# EAGLE design powersensor (EAGLE 7.7.0)
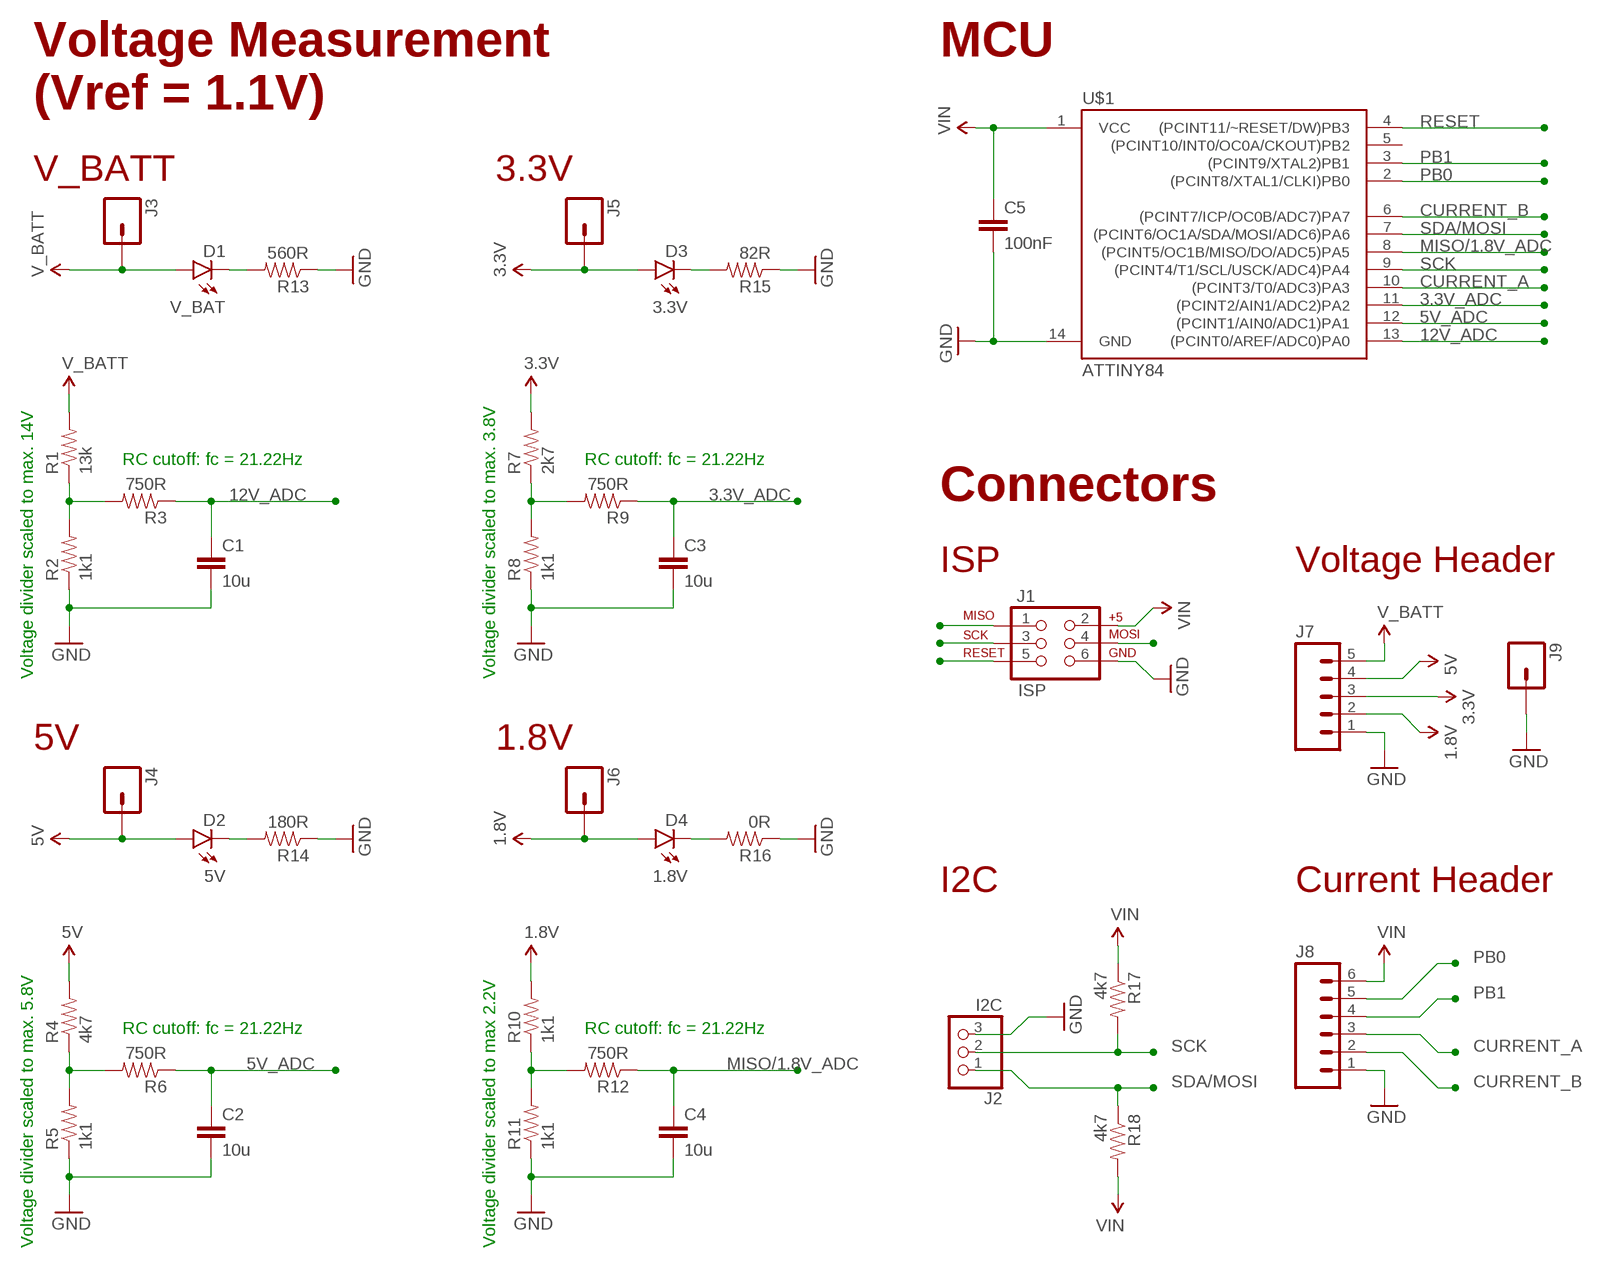
[diagram p0: schematic, sheet 1]

## Parts
C1  10u  CAP0603-CAP  [0603-CAP]
C2  10u  CAP0603-CAP  [0603-CAP]
C3  10u  CAP0603-CAP  [0603-CAP]
C4  10u  CAP0603-CAP  [0603-CAP]
C5  100nF  CAP0603-CAP  [0603-CAP]
D1  V_BAT  LED0603  [LED-0603]
D2  5V  LED0603  [LED-0603]
D3  3.3V  LED0603  [LED-0603]
D4  1.8V  LED0603  [LED-0603]
J1  ISP  AVR_SPI_PRG_6PTH  [2X3]
J2  I2C  PINHD-1X3/90  [1X03/90]
J3  M01PTH  [1X01]
J4  M01PTH  [1X01]
J5  M01PTH  [1X01]
J6  M01PTH  [1X01]
J7  M05PTH  [1X05]
J8  M06SILK_FEMALE_PTH  [1X06]
J9  M01PTH  [1X01]
R1  13k  RESISTOR0603-RES  [0603-RES]
R2  1k1  RESISTOR0603-RES  [0603-RES]
R3  750R  RESISTOR0603-RES  [0603-RES]
R4  4k7  RESISTOR0603-RES  [0603-RES]
R5  1k1  RESISTOR0603-RES  [0603-RES]
R6  750R  RESISTOR0603-RES  [0603-RES]
R7  2k7  RESISTOR0603-RES  [0603-RES]
R8  1k1  RESISTOR0603-RES  [0603-RES]
R9  750R  RESISTOR0603-RES  [0603-RES]
R10  1k1  RESISTOR0603-RES  [0603-RES]
R11  1k1  RESISTOR0603-RES  [0603-RES]
R12  750R  RESISTOR0603-RES  [0603-RES]
R13  560R  RESISTOR0603-RES  [0603-RES]
R14  180R  RESISTOR0603-RES  [0603-RES]
R15  82R  RESISTOR0603-RES  [0603-RES]
R16  0R  RESISTOR0603-RES  [0603-RES]
R17  4k7  RESISTOR0603-RES  [0603-RES]
R18  4k7  RESISTOR0603-RES  [0603-RES]
U$1  ATTINY84  [SO14]

## Nets
1.8V: D4.A J6.1 J7.2 R10.2
3.3V: D3.A J5.1 J7.3 R7.2
3.3V_ADC: C3.1 R9.1 U$1.11((PCINT2/AIN1/ADC2)PA2)
5V: D2.A J4.1 J7.4 R4.2
5V_ADC: C2.1 R6.1 U$1.12((PCINT1/AIN0/ADC1)PA1)
12V_ADC: C1.1 R3.1 U$1.13((PCINT0/AREF/ADC0)PA0)
CURRENT_A: J8.3 U$1.10((PCINT3/T0/ADC3)PA3)
CURRENT_B: J8.2 U$1.6((PCINT7/ICP/OC0B/ADC7)PA7)
GND: C1.2 C2.2 C3.2 C4.2 C5.2 J1.6 J2.3 J7.1 J8.1 J9.1 R2.1 R5.1 R8.1 R11.1 R13.1 R14.1 R15.1 R16.1 U$1.14(GND)
MISO/1.8V_ADC: C4.1 J1.1 R12.1 U$1.8((PCINT5/OC1B/MISO/DO/ADC5)PA5)
N$1: R1.1 R2.2 R3.2
N$2: R4.1 R5.2 R6.2
N$3: R7.1 R8.2 R9.2
N$4: R10.1 R11.2 R12.2
N$5: D1.C R13.2
N$6: D2.C R14.2
N$7: D3.C R15.2
N$8: D4.C R16.2
PB0: J8.5 U$1.2((PCINT8/XTAL1/CLKI)PB0)
PB1: J8.4 U$1.3((PCINT9/XTAL2)PB1)
RESET: J1.5 U$1.4((PCINT11/~RESET/DW)PB3)
SCK: J1.3 J2.2 R17.2 U$1.9((PCINT4/T1/SCL/USCK/ADC4)PA4)
SDA/MOSI: J1.4 J2.1 R18.1 U$1.7((PCINT6/OC1A/SDA/MOSI/ADC6)PA6)
V_BATT: D1.A J3.1 J7.5 R1.2
VIN: C5.1 J1.2 J8.6 R17.1 R18.2 U$1.1(VCC)
Unconnected: U$1.5((PCINT10/INT0/OC0A/CKOUT)PB2)

## Notes on the sheet
- MCU
- Voltage Measurement
  (Vref = 1.1V)
- V_BATT | 3.3V
- RC cutoff: fc = 21.22Hz | RC cutoff: fc = 21.22Hz
- Connectors
- ISP | Voltage Header
- Voltage divider scaled to max. 14V | Voltage divider scaled to max. 3.8V
- 5V | 1.8V
- I2C | Current Header
- RC cutoff: fc = 21.22Hz | RC cutoff: fc = 21.22Hz
- Voltage divider scaled to max. 5.8V | Voltage divider scaled to max 2.2V

## Library data of the parts
C1-C5 = SparkFun-Capacitors:CAP: Capacitor Standard 0603 ceramic capacitor, and 0.1" leaded capacitor.
D1-D4 = SparkFun-LED:LED: LEDs Standard schematic elements and footprints for 5mm, 3mm, 1206, and 0603 sized LEDs. 5mm - Spark Fun Electronics SKU : COM-00529 (and others)
J1 = SparkFun-Connectors:AVR_SPI_PRG_6: AVR ISP 6 Pin This is the reduced ISP connector for AVR programming. Common on Arduino. This footprint will take up less PCB space and can be used with a 10-pin to 6-pin adapter such as SKU: BOB-08508 **Special note about "TEST_POINT" package. The stop mask is on the top side, so if you want your programming test points to be on the bottom of your board, make sure to place this package on the bottom side of the board. This also ensure that the orientation to program from the bottom side will be correct.
J2 = pinhead:PINHD-1X3: PIN HEADER
J3-J6 J9 = SparkFun-Connectors:M01: Header 1 Standard 1-pin 0.1" header. Use with straight break away headers (SKU : PRT-00116), right angle break away headers (PRT-00553), swiss pins (PRT-00743), machine pins (PRT-00117), and female headers (PRT-00115). SMTSO-256-ET is a "flush mount" nut for a 4-40 screw. The older package used to be too tight, and did not allow it to sit properly thru the drill hit. The latest (0.165DIA) fits nice and snug.
J7 = SparkFun-Connectors:M05: Header 5 Standard 5-pin 0.1" header. Use with straight break away headers (SKU : PRT-00116), right angle break away headers (PRT-00553), swiss pins (PRT-00743), machine pins (PRT-00117), and female headers (PRT-00115). Molex polarized connector foot print use with SKU : PRT-08230 with associated crimp pins and housings.
J8 = SparkFun-Connectors:M06: Header 6 Standard 6-pin 0.1" header. Use with straight break away headers (SKU : PRT-00116), right angle break away headers (PRT-00553), swiss pins (PRT-00743), machine pins (PRT-00117), and female headers (PRT-00115). Molex polarized connector foot print use with SKU : PRT-08094 with associated crimp pins and housings. NOTES ON THE VARIANTS LOCK and LOCK_LONGPADS... This footprint was designed to help hold the alignment of a through-hole component (i.e. 6-pin header) while soldering it into place. You may notice that each hole has been shifted either up or down by 0.005 of an inch from it's more standard position (which is a perfectly straight line). This slight alteration caused the pins (the squares in the middle) to touch the edges of the holes. Because they are alternating, it causes a "brace" to hold the component in place. 0.005 has proven to be the perfect amount of "off-center" position when using our standard breakaway headers. Although looks a little odd when you look at the bare footprint, once you have a header in there, the alteration is very hard to notice. Also,if you push a header all the way into place, it is covered up entirely on the bottom side. This idea of altering the position of holes to aid alignment will be further integrated into the Sparkfun Library for other footprints. It can help hold any component with 3 or more connection pins.; PROD_ID: CONN-08437
R1-R18 = SparkFun-Passives:RESISTOR: Resistor Basic schematic elements and footprints for 0603, 1206, and PTH resistors.
U$1 = SparkFun-DigitalIC:ATTINY84: Atmel 14-pin 2/4/8kB flash uC; PROD_ID: IC-11285

## Board
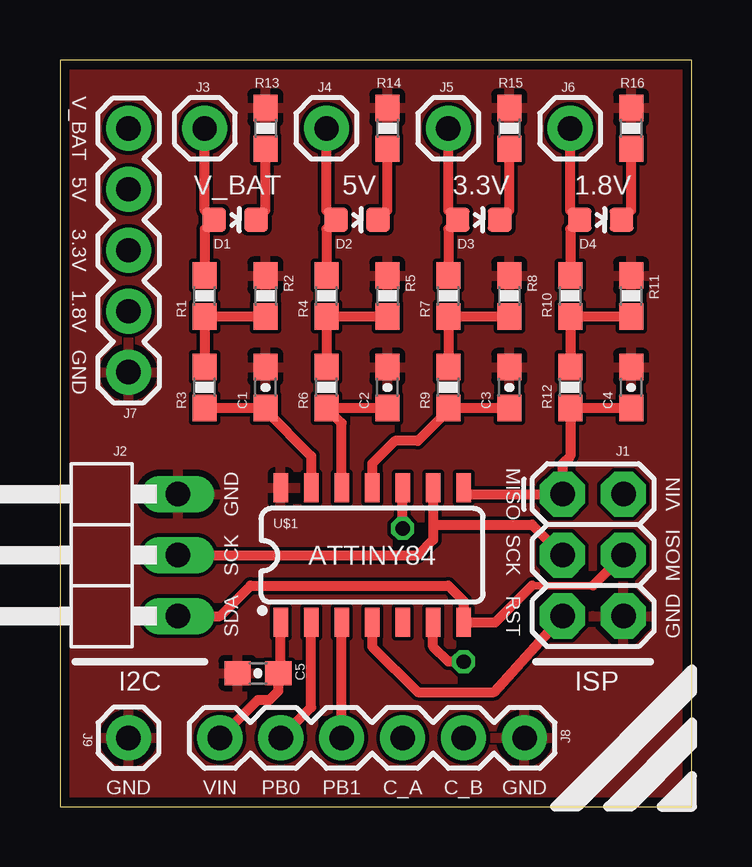
[diagram p1: board, top side]
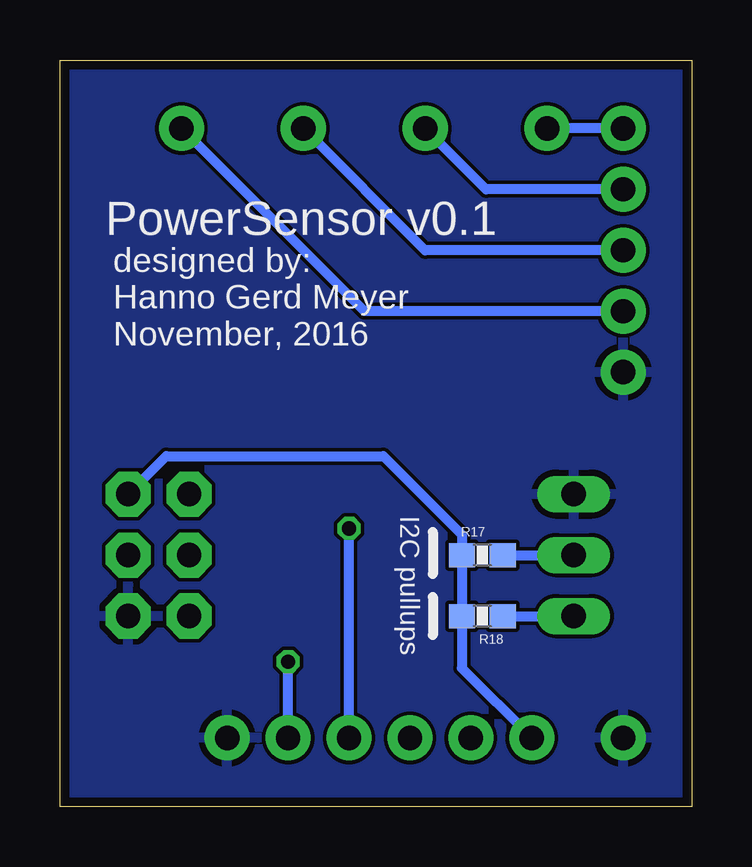
[diagram p2: board, bottom side, seen from below]

Size 26.34 x 31.11 mm. Coordinates in mm from the lower left corner, seen from the top.
Outline: 0,0 26.34,0 26.34,31.11 0,31.11 0,0
Copper layers (1*16): Top 0.0356mm / dielectric 1.5011mm / Bottom 0.0356mm
Design rules "oshpark-2layer": minimum track width 6mil, minimum drill 13mil, track to track 6mil, track to pad 6mil, pad to pad 6mil, via to via 6mil, smd to smd 6mil, copper to edge 15mil, drill to drill 6mil, minimum pad ring 7mil, minimum via ring 7mil, stop-mask expansion 2.5mil, vias tented up to drill 0mil, thermal gap 10mil

### Footprints (pad centres in the part's own frame; a part is rotated, then mirrored left to right if it is on the bottom)
0603-CAP = smd 1.1 x 1: 1 -0.85,0; 2 0.85,0
LED-0603 = smd 1 x 1: A 0,-0.877; C 0,0.877
2X3 = drill 1.016 pad 1.88 octagon: 1 0,0; 2 0,2.54; 3 2.54,0; 4 2.54,2.54; 5 5.08,0; 6 5.08,2.54
1X03/90 = drill 1.016 long: 1 -2.54,-3.81; 2 0,-3.81; 3 2.54,-3.81
1X01 = drill 1.016 pad 1.88: 1 0,0
1X05 = drill 1.016 pad 1.88: 1 0,0; 2 2.54,0; 3 5.08,0; 4 7.62,0; 5 10.16,0
1X06 = drill 1.016 pad 1.88: 1 0,0; 2 2.54,0; 3 5.08,0; 4 7.62,0; 5 10.16,0; 6 12.7,0
0603-RES = smd 1.1 x 1: 1 -0.85,0; 2 0.85,0
SO14 = smd 0.6 x 1.2: 1 -3.81,-2.8; 2 -2.54,-2.8; 3 -1.27,-2.8; 4 0,-2.8; 5 1.27,-2.8; 6 2.54,-2.8; 7 3.81,-2.8; 8 3.81,2.8; 9 2.54,2.8; 10 1.27,2.8; 11 0,2.8; 12 -1.27,2.8; 13 -2.54,2.8; 14 -3.81,2.8

### Placement (x,y rotation side)
C1  8.57,17.46 90 top
C2  13.65,17.46 90 top
C3  18.73,17.46 90 top
C4  23.81,17.46 90 top
C5  8.26,5.56 180 top
D1  7.3,24.45 270 top
D2  12.38,24.45 270 top
D3  17.46,24.45 270 top
D4  22.54,24.45 270 top
J1  20.95,13.02 270 top
J2  1.11,10.48 90 top
J3  6.03,28.26 90 top
J4  11.11,28.26 90 top
J5  16.19,28.26 90 top
J6  21.27,28.26 270 top
J7  2.86,18.1 90 top
J8  19.37,2.86 180 top
J9  2.86,2.86 0 top
R1  6.03,21.27 90 top
R2  8.57,21.27 270 top
R3  6.03,17.46 90 top
R4  11.11,21.27 90 top
R5  13.65,21.27 270 top
R6  11.11,17.46 90 top
R7  16.19,21.27 90 top
R8  18.73,21.27 270 top
R9  16.19,17.46 90 top
R10  21.27,21.27 90 top
R11  23.81,21.27 270 top
R12  21.27,17.46 90 top
R13  8.57,28.26 270 top
R14  13.65,28.26 270 top
R15  18.73,28.26 270 top
R16  23.81,28.26 270 top
R17  8.73,10.48 0 bottom
R18  8.73,7.94 180 bottom
U$1  13.02,10.48 0 top

### Tracks (layer width: path | path; a pad name or v marks a point on that pad's centre or on a via)
1.8V
  Top 0.406: J6.1 21.27,24.84 D4.A 21.27,24.05 R10.2
  Bottom 0.406: J7.2 13.65,20.64 J6.1
3.3V
  Top 0.406: J5.1 16.19,24.84 D3.A 16.19,24.05 R7.2
  Bottom 0.406: J7.3 11.11,23.18 J5.1
3.3V_ADC
  Top 0.406: C3.1 R9.1 16.19,16.51 14.92,15.24 13.97,15.24 13.02,14.29 U$1.11
5V
  Top 0.406: J4.1 11.11,24.84 D2.A 11.11,24.05 R4.2
  Bottom 0.406: J7.4 8.57,25.72 J4.1
5V_ADC
  Top 0.406: C2.1 R6.1 11.75,15.98 U$1.12
12V_ADC
  Top 0.406: R3.1 C1.1 8.57,16.51 10.48,14.61 U$1.13
CURRENT_A  (via drill 0.6)
  Top 0.406: v14.29,11.59 U$1.10
  Bottom 0.406: J8.3 v14.29,11.59
CURRENT_B  (via drill 0.6)
  Top 0.406: v16.83,6.03 16.19,6.03 15.56,6.67 U$1.6
  Bottom 0.406: J8.2 v16.83,6.03
GND
  pour Top: 0,31.11 26.35,31.11 26.35,0 0,0
  pour Bottom: 0,31.11 26.35,31.11 26.35,0 0,0
MISO/1.8V_ADC
  Top 0.406: C4.1 R12.1 21.27,14.61 20.95,14.29 J1.1 16.83,13.02 U$1.8
N$1
  Top 0.406: R3.2 R1.1 R2.2
N$2
  Top 0.406: R5.2 R4.1 R6.2
N$3
  Top 0.406: R8.2 R7.1 R9.2
N$4
  Top 0.406: R11.2 R10.1 R12.2 21.27,18.73
N$5
  Top 0.406: D1.C 8.57,24.84 R13.2
N$6
  Top 0.406: D2.C 13.65,24.84 R14.2
N$7
  Top 0.406: D3.C 18.73,24.84 R15.2
N$8
  Top 0.406: D4.C 23.81,24.84 R16.2
PB0
  Top 0.406: J8.5 10.48,4.13 U$1.2
PB1
  Top 0.406: J8.4 U$1.3
RESET
  Top 0.406: U$1.4 13.02,6.67 14.92,4.76 18.1,4.76 J1.5
SCK
  Top 0.406: 15.56,11.75 19.68,11.75 J1.3 | J2.2 14.92,10.48 15.56,11.11 15.56,11.75 | U$1.9 15.56,11.75
  Bottom 0.406: R17.2 J2.2
SDA/MOSI
  Top 0.305: 19.68,9.21 22.23,9.21
  Top 0.406: 19.68,9.21 18.16,7.68 U$1.7 16.83,8.57 16.19,9.21 7.94,9.21 6.67,7.94 J2.1 | 22.23,9.21 J1.4
  Bottom 0.406: R18.1 J2.1
V_BATT
  Top 0.406: J3.1 6.03,24.84 D1.A 6.03,24.05 R1.2
  Bottom 0.406: J7.5 J3.1
VIN
  Top 0.406: U$1.1 9.21,5.66 C5.1 9.11,4.82 8.73,4.45 8.26,4.45 J8.6
  Bottom 0.406: J1.2 21.91,14.61 12.86,14.61 9.58,11.33 R17.1 R18.2 9.58,5.77 J8.6

### Text on the board
tNames: V_BAT | 5V | 3.3V | 1.8V | GND | GND | MISO | VIN | SCK | SCK | MOSI | SDA | RST | GND | GND | VIN | PB0 | PB1 | C_A | C_B | GND
bNames: PowerSensor v0.1 | designed by: / Hanno Gerd Meyer / November, 2016 | I2C pullups